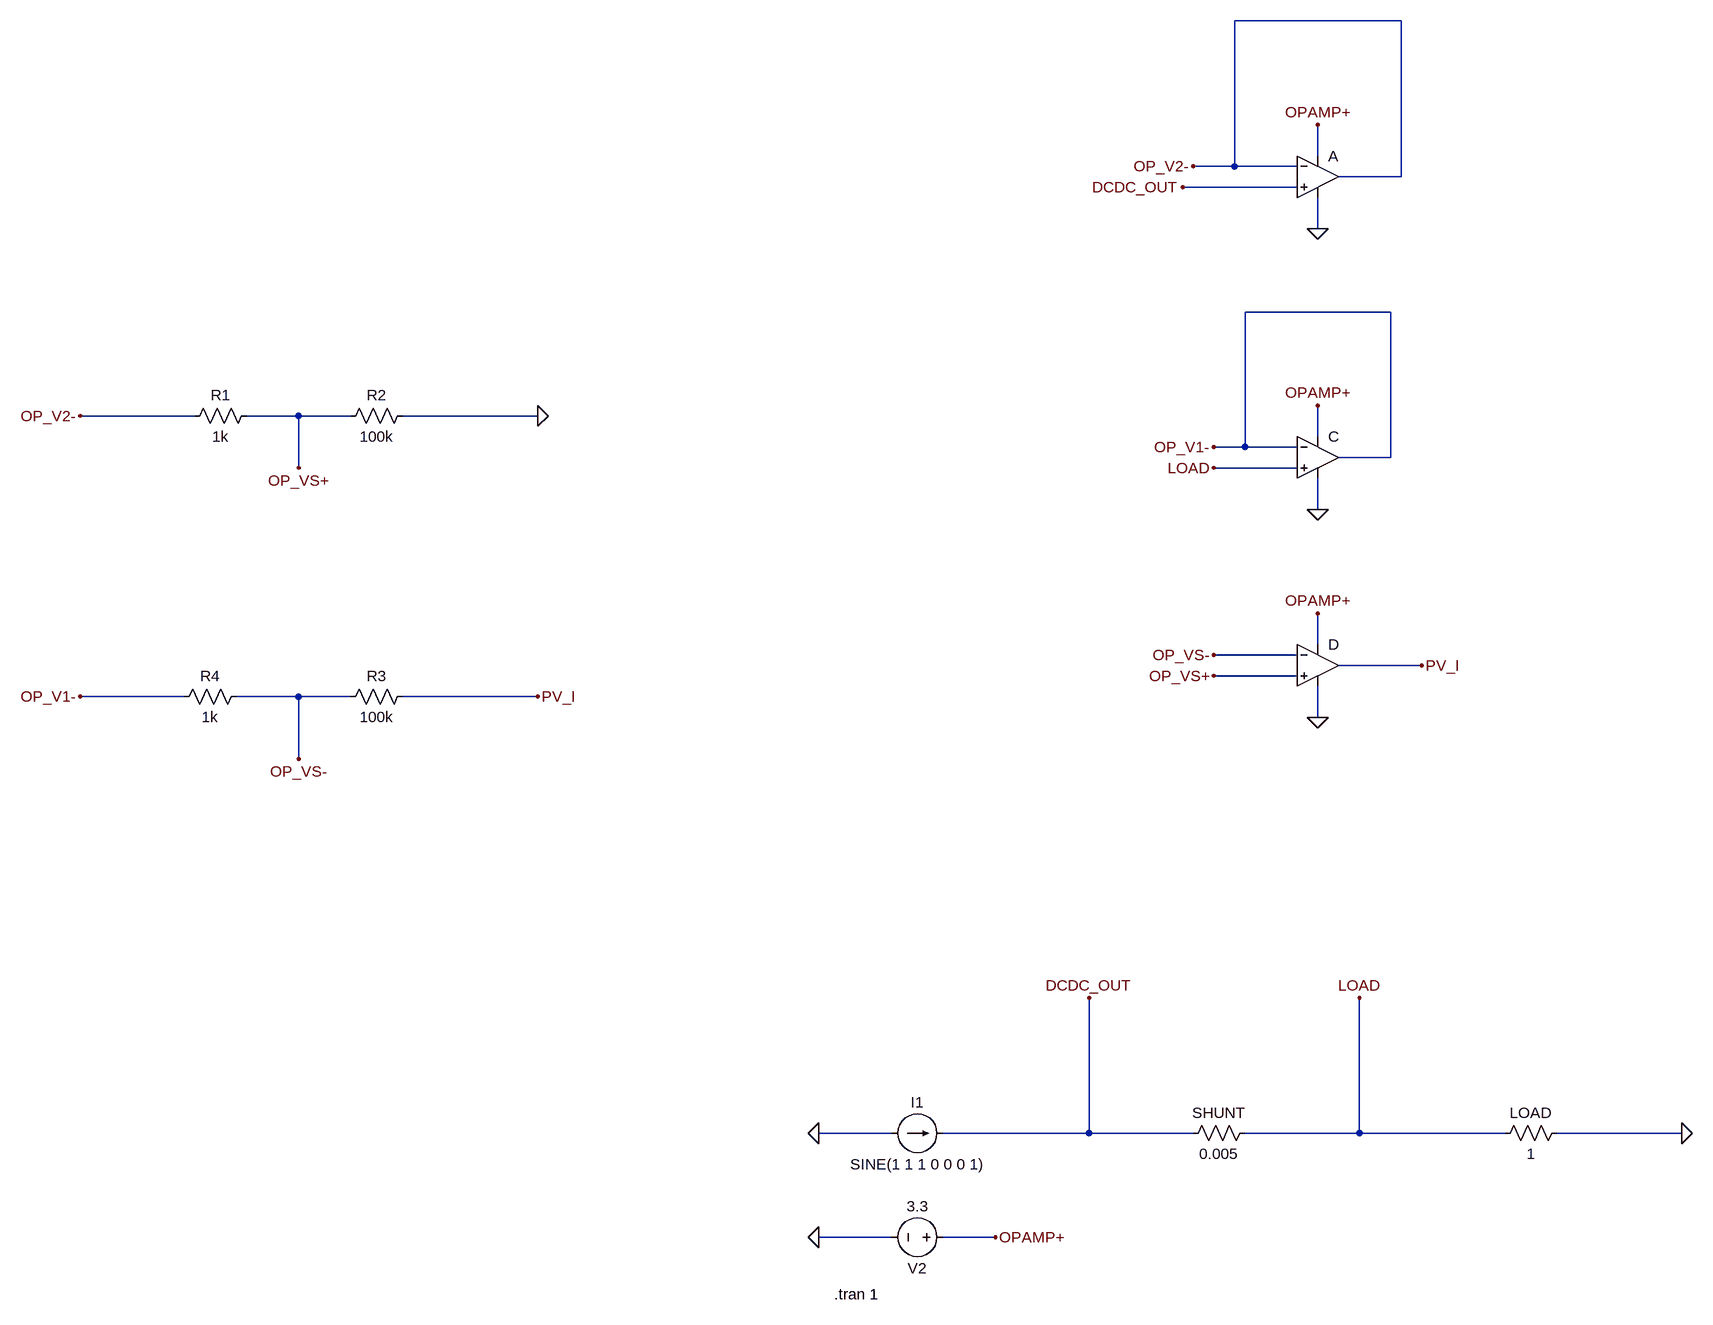
[diagram p0: schematic Current Sensing Block V2 (PV).asc]
Current Sensing Block V2 (PV).asc, the LTspice schematic file:
Version 4
SHEET 1 1476 2040
WIRE 352 -192 96 -192
WIRE 224 16 224 -32
WIRE 96 32 96 -192
WIRE 96 32 32 32
WIRE 192 32 96 32
WIRE 352 48 352 -192
WIRE 352 48 256 48
WIRE 192 64 16 64
WIRE 224 128 224 80
WIRE 336 256 112 256
WIRE -1504 416 -1680 416
WIRE -1344 416 -1424 416
WIRE -1264 416 -1344 416
WIRE -976 416 -1184 416
WIRE 224 448 224 400
WIRE 112 464 112 256
WIRE 112 464 64 464
WIRE 192 464 112 464
WIRE 336 480 336 256
WIRE 336 480 256 480
WIRE -1344 496 -1344 416
WIRE 192 496 64 496
WIRE 224 560 224 512
WIRE 224 768 224 720
WIRE 192 784 64 784
WIRE 384 800 256 800
WIRE 192 816 64 816
WIRE -1520 848 -1680 848
WIRE -1344 848 -1440 848
WIRE -1264 848 -1344 848
WIRE -976 848 -1184 848
WIRE 224 880 224 832
WIRE -1344 944 -1344 848
WIRE -432 1520 -544 1520
WIRE -128 1520 -128 1312
WIRE -128 1520 -352 1520
WIRE 32 1520 -128 1520
WIRE 288 1520 288 1312
WIRE 288 1520 112 1520
WIRE 512 1520 288 1520
WIRE 784 1520 592 1520
WIRE -432 1680 -544 1680
WIRE -272 1680 -352 1680
FLAG -544 1520 0
FLAG 784 1520 0
FLAG 224 560 0
FLAG 224 400 OPAMP+
FLAG -544 1680 0
FLAG -272 1680 OPAMP+
FLAG -128 1312 DCDC_OUT
FLAG 288 1312 LOAD
FLAG -976 848 PV_I
FLAG 224 -32 OPAMP+
FLAG 224 128 0
FLAG 16 64 DCDC_OUT
FLAG -1680 416 OP_V2-
FLAG -1680 848 OP_V1-
FLAG -1344 496 OP_VS+
FLAG -976 416 0
FLAG 32 32 OP_V2-
FLAG 64 496 LOAD
FLAG 64 464 OP_V1-
FLAG -1344 944 OP_VS-
FLAG 224 720 OPAMP+
FLAG 224 880 0
FLAG 64 816 OP_VS+
FLAG 64 784 OP_VS-
FLAG 384 800 PV_I
SYMBOL res -1408 400 R90
WINDOW 0 0 56 VBottom 2
WINDOW 3 32 56 VTop 2
SYMATTR InstName R1
SYMATTR Value 1k
SYMBOL res -1168 400 R90
WINDOW 0 0 56 VBottom 2
WINDOW 3 32 56 VTop 2
SYMATTR InstName R2
SYMATTR Value 100k
SYMBOL res -1168 832 R90
WINDOW 0 0 56 VBottom 2
WINDOW 3 32 56 VTop 2
SYMATTR InstName R3
SYMATTR Value 100k
SYMBOL res -1424 832 R90
WINDOW 0 0 56 VBottom 2
WINDOW 3 32 56 VTop 2
SYMATTR InstName R4
SYMATTR Value 1k
SYMBOL res 16 1536 R270
WINDOW 0 32 56 VTop 2
WINDOW 3 0 56 VBottom 2
SYMATTR InstName SHUNT
SYMATTR Value 0.005
SYMBOL current -432 1520 R270
WINDOW 0 32 40 VTop 2
WINDOW 3 -32 40 VBottom 2
WINDOW 123 0 0 Left 0
WINDOW 39 0 0 Left 0
SYMATTR InstName I1
SYMATTR Value SINE(1 1 1 0 0 0 1)
SYMBOL voltage -336 1680 R90
WINDOW 0 32 56 VTop 2
WINDOW 3 -32 56 VBottom 2
WINDOW 123 0 0 Left 0
WINDOW 39 0 0 Left 0
SYMATTR InstName V2
SYMATTR Value 3.3
SYMBOL res 496 1536 R270
WINDOW 0 32 56 VTop 2
WINDOW 3 0 56 VBottom 2
SYMATTR InstName LOAD
SYMATTR Value 1
SYMBOL OpAmps\\UniversalOpAmp2 224 48 R0
SYMATTR InstName A
SYMBOL OpAmps\\UniversalOpAmp2 224 480 R0
SYMATTR InstName C
SYMBOL OpAmps\\UniversalOpAmp2 224 800 R0
SYMATTR InstName D
TEXT -520 1768 Left 2 !.tran 1

The netlist it stands for:
* Current Sensing Block V2 (PV).asc
R1 OP_VS+ OP_V2- 1k
R2 0 OP_VS+ 100k
R3 PV_I OP_VS- 100k
R4 OP_VS- OP_V1- 1k
R§SHUNT DCDC_OUT LOAD 0.005
I1 0 DCDC_OUT SINE(1 1 1 0 0 0 1)
V2 OPAMP+ 0 3.3
R§LOAD LOAD 0 1
XA DCDC_OUT OP_V2- OPAMP+ 0 OP_V2- level2 Avol=1Meg GBW=10Meg Slew=10Meg Ilimit=25m Rail=0 Vos=0 En=0 Enk=0 In=0 Ink=0 Rin=500Meg  ; pins In+ In- V+ V- OUT
XC LOAD OP_V1- OPAMP+ 0 OP_V1- level2 Avol=1Meg GBW=10Meg Slew=10Meg Ilimit=25m Rail=0 Vos=0 En=0 Enk=0 In=0 Ink=0 Rin=500Meg  ; pins In+ In- V+ V- OUT
XD OP_VS+ OP_VS- OPAMP+ 0 PV_I level2 Avol=1Meg GBW=10Meg Slew=10Meg Ilimit=25m Rail=0 Vos=0 En=0 Enk=0 In=0 Ink=0 Rin=500Meg  ; pins In+ In- V+ V- OUT
.tran 1
.lib UniversalOpAmp2.lib
.backanno
.end

* Results of the author's LTspice run, read from the files saved beside the schematic
* Operating Point, zero values left out:
*   V(op_vs+) = 995.1 mV
*   V(op_v2-) = 1.005 V
*   V(pv_i) = 500.1 mV
*   V(op_vs-) = 995.1 mV
*   V(op_v1-) = 1 V
*   V(dcdc_out) = 1.005 V
*   V(load) = 1 V
*   V(opamp+) = 3.3 V
*   I(I1) = 1 A
*   I(Load) = 1 A
*   I(Shunt) = 1 A
*   I(R4) = -4.948 µA
*   I(R3) = -4.949 µA
*   I(R2) = -9.951 µA
*   I(R1) = -9.949 µA
*   I(V2) = -427 µA
*   Ix(a:1) = -1.29 nA
*   Ix(a:2) = -1.29 nA
*   Ix(a:3) = 156.9 µA
*   Ix(a:4) = -147 µA
*   Ix(a:5) = -9.948 µA
*   Ix(c:1) = -1.3 nA
*   Ix(c:2) = -1.3 nA
*   Ix(c:3) = 154.2 µA
*   Ix(c:4) = -149.2 µA
*   Ix(c:5) = -4.947 µA
*   Ix(d:1) = -1.31 nA
*   Ix(d:2) = -1.31 nA
*   Ix(d:3) = 115.9 µA
*   Ix(d:4) = -120.8 µA
*   Ix(d:5) = 4.949 µA
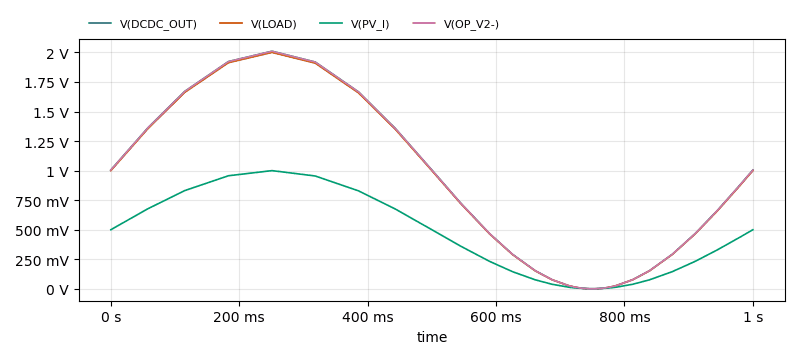
[diagram p1: Transient Analysis of Current Sensing Block V2 (PV).asc, plotted from the saved traces]
* Transient Analysis, 1 run:
*   V(DCDC_OUT): min 9.569 µV, max 2.01 V, average 1.001 V, rms 1.228 V, last 1.005 V
*   V(LOAD): min 9.521 µV, max 2 V, average 996.4 mV, rms 1.222 V, last 1 V
*   V(PV_I): min 1.557 mV, max 1 V, average 498.4 mV, rms 610.9 mV, last 500.1 mV
*   V(OP_V2-): min 81.43 µV, max 2.01 V, average 1.001 V, rms 1.228 V, last 1.005 V